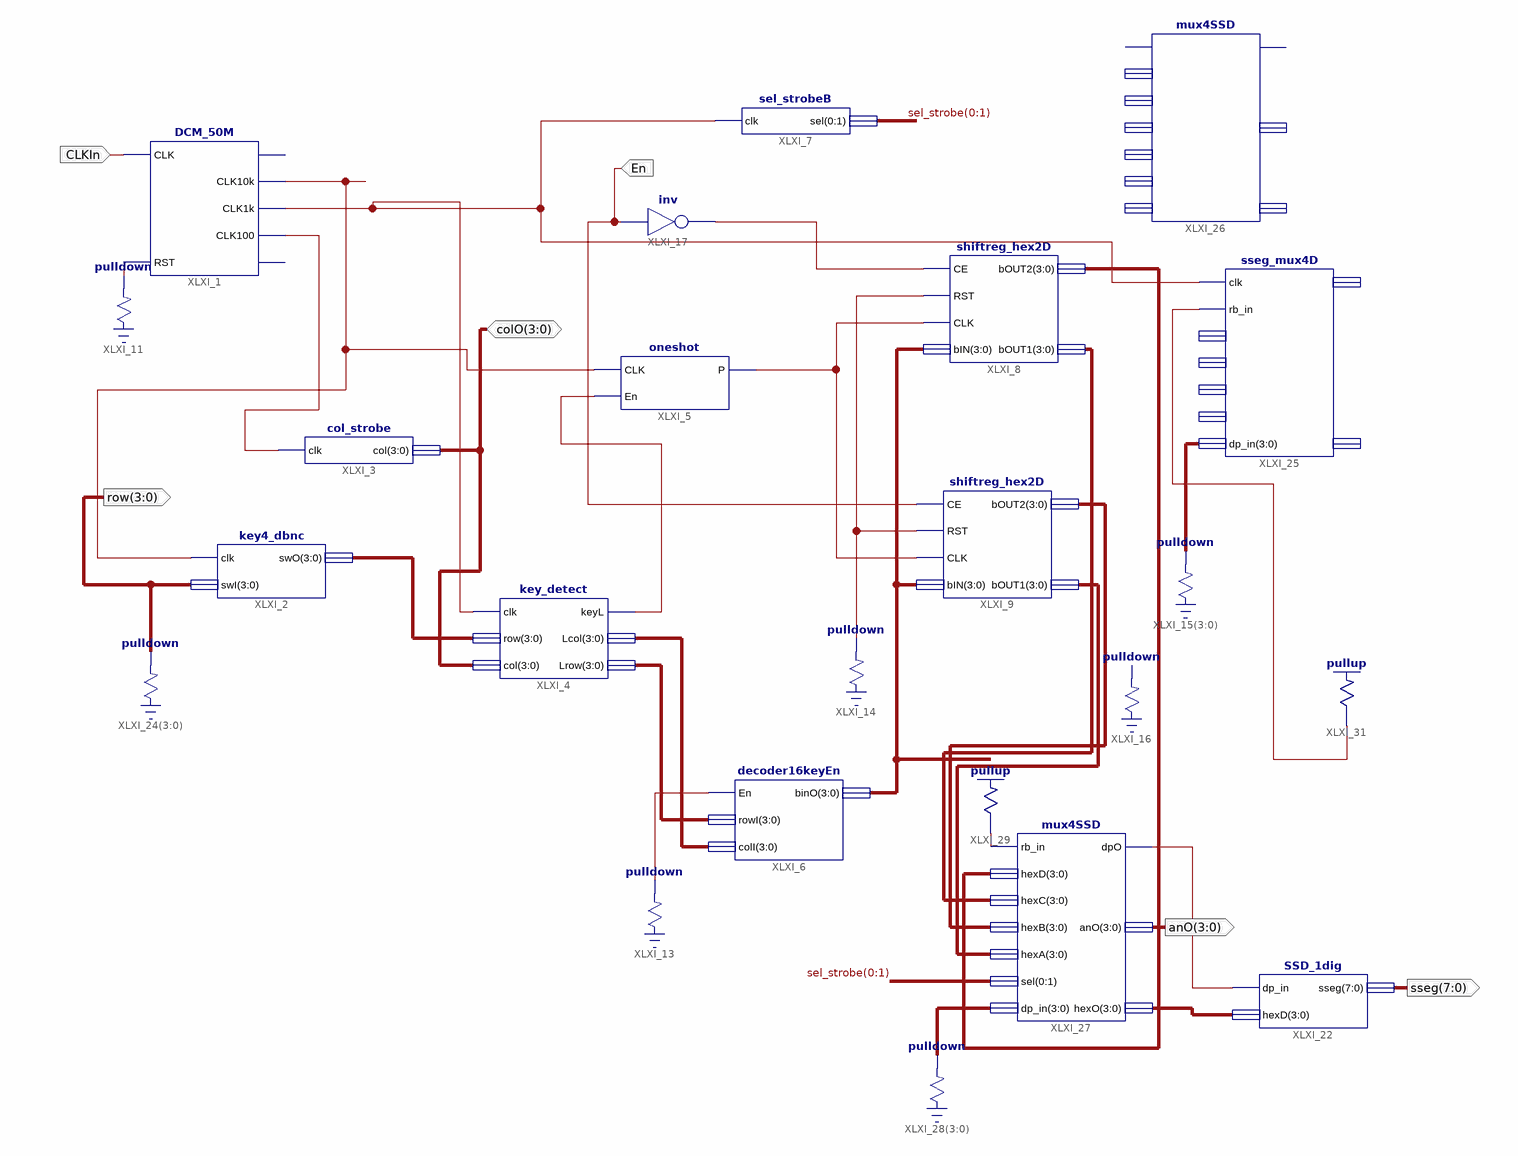
[diagram p0: schematic sheet 1]
// Xilinx ISE schematic lab_final_KEYPAD.sch (spartan3e) as structural Verilog: 23 symbols, 6 ports
module lab_final_KEYPAD (
  input  CLKIn,
  input  En,
  inout  [3:0] colO,
  output [3:0] row,
  output [3:0] anO,
  output [7:0] sseg
);

  wire XLXN_2, XLXN_7, XLXN_13, XLXN_17, XLXN_25, XLXN_27, XLXN_32, XLXN_56, XLXN_57, XLXN_66, XLXN_70,
       XLXN_83;
  wire [1:0] sel_strobe;
  wire [3:0] XLXN_19, XLXN_21, XLXN_22, XLXN_23, XLXN_40, XLXN_65, XLXN_69, XLXN_90, XLXN_91, XLXN_92,
       XLXN_93;

  DCM_50M XLXI_1 (.CLK(CLKIn), .RST(XLXN_2), .CLK10k(XLXN_17), .CLK1k(XLXN_13), .CLK100(XLXN_56));  // open: CLK1M, CLK1
  key4_dbnc XLXI_2 (.clk(XLXN_17), .swI(row), .swO(XLXN_19));
  col_strobe XLXI_3 (.clk(XLXN_56), .col(colO));
  key_detect XLXI_4 (.clk(XLXN_13), .row(XLXN_19), .col(colO), .keyL(XLXN_57), .Lcol(XLXN_21), .Lrow(XLXN_22));
  oneshot XLXI_5 (.CLK(XLXN_17), .En(XLXN_57), .P(XLXN_27));
  decoder16keyEn XLXI_6 (.En(XLXN_7), .rowI(XLXN_22), .colI(XLXN_21), .binO(XLXN_23));
  sel_strobeB XLXI_7 (.clk(XLXN_13), .sel({sel_strobe[0], sel_strobe[1]}));
  shiftreg_hex2D XLXI_8 (.CE(XLXN_32), .RST(XLXN_25), .CLK(XLXN_27), .bIN(XLXN_23), .bOUT2(XLXN_90), .bOUT1(XLXN_91));
  shiftreg_hex2D XLXI_9 (.CE(En), .RST(XLXN_25), .CLK(XLXN_27), .bIN(XLXN_23), .bOUT2(XLXN_92), .bOUT1(XLXN_93));
  \pulldown  XLXI_11 (.O(XLXN_2));
  \pulldown  XLXI_13 (.O(XLXN_7));
  \pulldown  XLXI_14 (.O(XLXN_25));
  \pulldown  XLXI_15[3:0] (.O(XLXN_40));
  \pulldown  XLXI_16 ();  // open: O
  not XLXI_17 (XLXN_32, En);
  \pulldown  XLXI_24[3:0] (.O(row));
  sseg_mux4D XLXI_25 (.clk(XLXN_13), .rb_in(XLXN_83), .dp_in(XLXN_40));  // open: hexD, hexC, hexB, hexA, anO, ssegO
  mux4SSD XLXI_26 ();  // open: rb_in, hexD, hexC, hexB, hexA, sel, dp_in, dpO, anO, hexO
  mux4SSD XLXI_27 (
    .rb_in(XLXN_70), .hexD(XLXN_90), .hexC(XLXN_91), .hexB(XLXN_92), .hexA(XLXN_93),
    .sel({sel_strobe[0], sel_strobe[1]}), .dp_in(XLXN_69), .dpO(XLXN_66), .anO(anO), .hexO(XLXN_65));
  \pulldown  XLXI_28[3:0] (.O(XLXN_69));
  \pullup  XLXI_29 (.O(XLXN_70));
  SSD_1dig XLXI_22 (.dp_in(XLXN_66), .hexD(XLXN_65), .sseg(sseg));
  \pullup  XLXI_31 (.O(XLXN_83));
endmodule
